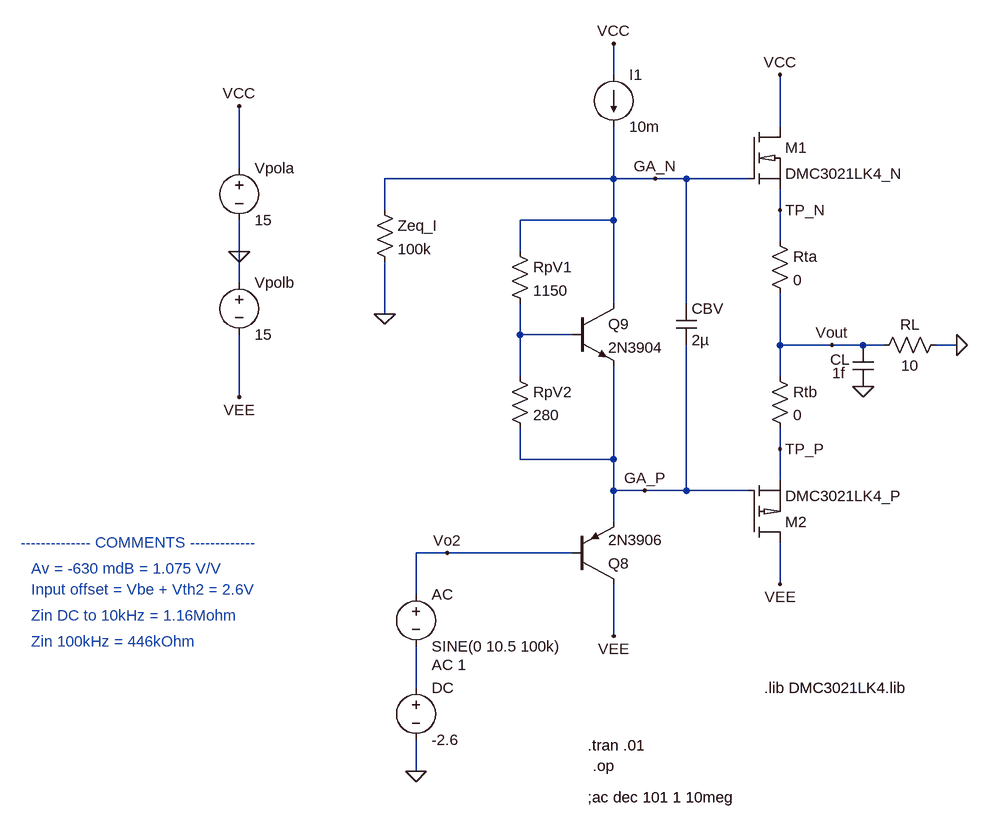
[diagram p0: schematic LT_ETAGE_3.asc]
LT_ETAGE_3.asc, the LTspice schematic file:
Version 4
SHEET 1 2404 1432
WIRE 1232 -336 1232 -384
WIRE 1488 -256 1488 -336
WIRE 656 -192 656 -288
WIRE 1232 -176 1232 -256
WIRE 1232 -176 880 -176
WIRE 1296 -176 1232 -176
WIRE 1344 -176 1296 -176
WIRE 1440 -176 1344 -176
WIRE 880 -128 880 -176
WIRE 1488 -128 1488 -160
WIRE 1232 -112 1232 -176
WIRE 1232 -112 1088 -112
WIRE 1488 -80 1488 -128
WIRE 656 -64 656 -112
WIRE 1088 -64 1088 -112
WIRE 656 -16 656 -64
WIRE 1232 16 1232 -112
WIRE 1344 16 1344 -176
WIRE 880 32 880 -48
WIRE 1088 64 1088 16
WIRE 1168 64 1088 64
WIRE 1488 80 1488 0
WIRE 1568 80 1488 80
WIRE 1616 80 1568 80
WIRE 1648 80 1616 80
WIRE 1760 80 1728 80
WIRE 1088 128 1088 64
WIRE 1488 128 1488 80
WIRE 656 160 656 64
WIRE 1488 240 1488 208
WIRE 1088 256 1088 208
WIRE 1232 256 1232 112
WIRE 1232 256 1088 256
WIRE 1488 288 1488 240
WIRE 1232 304 1232 256
WIRE 1280 304 1232 304
WIRE 1344 304 1344 80
WIRE 1344 304 1280 304
WIRE 1440 304 1344 304
WIRE 1232 352 1232 304
WIRE 976 400 928 400
WIRE 1168 400 976 400
WIRE 1488 448 1488 384
WIRE 928 464 928 400
WIRE 1232 528 1232 448
WIRE 928 608 928 544
WIRE 928 736 928 688
FLAG 656 -288 VCC
FLAG 656 160 VEE
FLAG 656 -64 0
FLAG 1760 80 0
FLAG 1488 -336 VCC
FLAG 1488 448 VEE
FLAG 1232 528 VEE
FLAG 1296 -176 GA_N
FLAG 1280 304 GA_P
FLAG 1568 80 Vout
FLAG 1488 -128 TP_N
FLAG 1488 240 TP_P
FLAG 1616 144 0
FLAG 1232 -384 VCC
FLAG 880 32 0
FLAG 976 400 Vo2
FLAG 928 736 0
SYMBOL voltage 656 -208 R0
WINDOW 123 0 0 Left 0
WINDOW 39 0 0 Left 0
SYMATTR InstName Vpola
SYMATTR Value 15
SYMBOL voltage 656 -32 R0
WINDOW 123 0 0 Left 0
WINDOW 39 0 0 Left 0
SYMATTR InstName Vpolb
SYMATTR Value 15
SYMBOL res 1472 -96 R0
SYMATTR InstName Rta
SYMATTR Value 0
SYMBOL res 1472 112 R0
SYMATTR InstName Rtb
SYMATTR Value 0
SYMBOL res 1744 64 R90
WINDOW 0 0 56 VBottom 2
WINDOW 3 32 56 VTop 2
SYMATTR InstName RL
SYMATTR Value 10
SYMBOL npn 1168 16 R0
SYMATTR InstName Q9
SYMATTR Value 2N3904
SYMBOL res 1072 -80 R0
SYMATTR InstName RpV1
SYMATTR Value 1150
SYMBOL res 1072 112 R0
SYMATTR InstName RpV2
SYMATTR Value 280
SYMBOL pnp 1168 448 M180
SYMATTR InstName Q8
SYMATTR Value 2N3906
SYMBOL cap 1328 16 R0
SYMATTR InstName CBV
SYMATTR Value 2µ
SYMBOL cap 1600 80 R0
WINDOW 0 -35 22 Left 2
WINDOW 3 -32 43 Left 2
SYMATTR InstName CL
SYMATTR Value 1f
SYMBOL nmos_3021 1440 -256 R0
SYMATTR InstName M1
SYMBOL pmos_3021 1440 384 M180
SYMATTR InstName M2
SYMBOL current 1232 -336 R0
WINDOW 123 0 0 Left 0
WINDOW 39 0 0 Left 0
SYMATTR InstName I1
SYMATTR Value 10m
SYMBOL res 864 -144 R0
SYMATTR InstName Zeq_I
SYMATTR Value 100k
SYMBOL voltage 928 448 R0
WINDOW 123 24 124 Left 2
WINDOW 39 0 0 Left 0
SYMATTR Value2 AC 1
SYMATTR InstName AC
SYMATTR Value SINE(0 10.5 100k)
SYMBOL voltage 928 592 R0
WINDOW 123 0 0 Left 0
WINDOW 39 0 0 Left 0
SYMATTR InstName DC
SYMATTR Value -2.6
TEXT 1200 728 Left 2 !.op
TEXT 1192 776 Left 2 !;ac dec 101 1 10meg
TEXT 1192 696 Left 2 !.tran .01
TEXT 1464 608 Left 2 !.lib DMC3021LK4.lib
TEXT 320 384 Left 2 ;-------------- COMMENTS -------------
TEXT 336 424 Left 2 ;Av = -630 mdB = 1.075 V/V
TEXT 336 456 Left 2 ;Input offset = Vbe + Vth2 = 2.6V
TEXT 336 496 Left 2 ;Zin DC to 10kHz = 1.16Mohm
TEXT 336 536 Left 2 ;Zin 100kHz = 446kOhm

The netlist it stands for:
* LT_ETAGE_3.asc
Vpola VCC 0 15
Vpolb 0 VEE 15
Rta TP_N Vout 0
Rtb Vout TP_P 0
RL 0 Vout 10
Q9 GA_N N001 GA_P 0 2N3904
RpV1 GA_N N001 1150
RpV2 N001 GA_P 280
Q8 VEE Vo2 GA_P 0 2N3906
CBV GA_N GA_P 2µ
CL Vout 0 1f
XM1 VCC GA_N TP_N DMC3021LK4_N  ; pins D G S
XM2 VEE GA_P TP_P DMC3021LK4_P  ; pins D G S
I1 VCC GA_N 10m
R§Zeq_I GA_N 0 100k
V§AC Vo2 N002 SINE(0 10.5 100k) AC 1
V§DC N002 0 -2.6
.model NPN NPN
.model PNP PNP
.lib standard.bjt
.op
;ac dec 101 1 10meg
.tran .01
.lib DMC3021LK4.lib
* -------------- COMMENTS -------------
* Av = -630 mdB = 1.075 V/V
* Input offset = Vbe + Vth2 = 2.6V
* Zin DC to 10kHz = 1.16Mohm
* Zin 100kHz = 446kOhm
.lib DMC3021LK4.lib
.backanno
.end